# EAGLE design DVK2C-breakout (EAGLE 9.0.1)
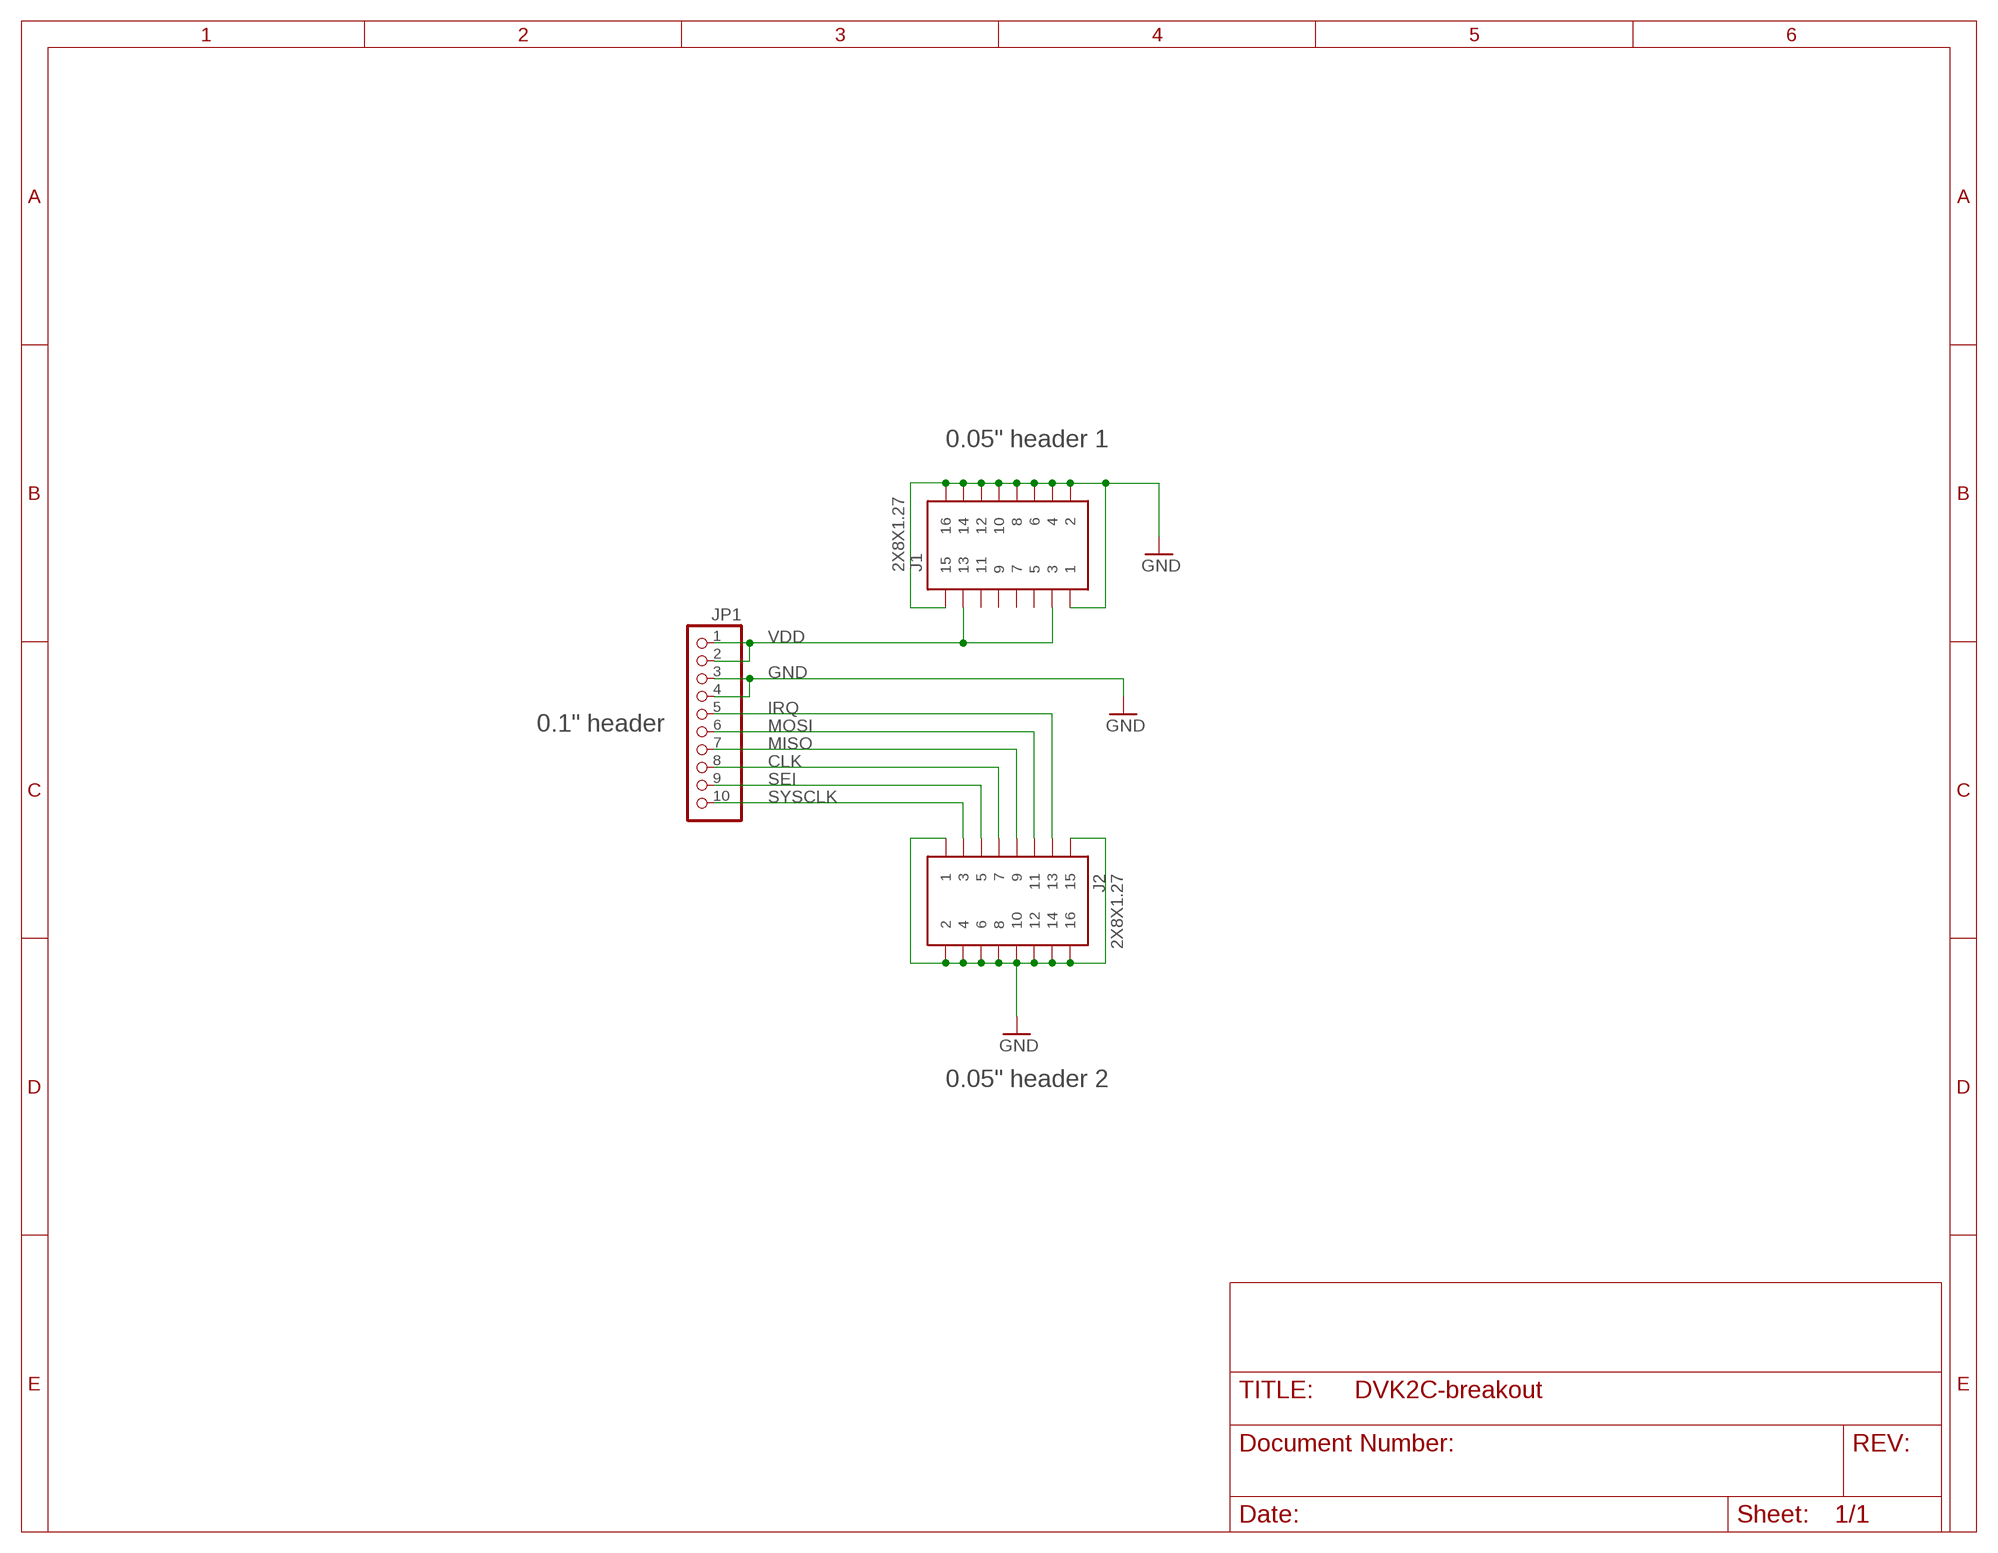
[diagram p0: schematic, sheet 1]

## Parts
J1  2X8X1.27  [2X8X1.27]
J2  2X8X1.27  [2X8X1.27]
JP1  PINHD-1X10  [1X10]

## Nets
CLK: J2.7 JP1.8
GND: J1.1 J1.2 J1.4 J1.6 J1.8 J1.10 J1.12 J1.14 J1.15 J1.16 J2.1 J2.2 J2.4 J2.6 J2.8 J2.10 J2.12 J2.14 J2.15 J2.16 JP1.3 JP1.4
IRQ: J2.13 JP1.5
MISO: J2.9 JP1.7
MOSI: J2.11 JP1.6
SEI: J2.5 JP1.9
SYSCLK: J2.3 JP1.10
VDD: J1.3 J1.13 JP1.1 JP1.2
Unconnected: J1.5 J1.7 J1.9 J1.11

## Notes on the sheet
- 0.05" header 1
- 0.1" header
- 0.05" header 2

## Library data of the parts
J1 J2 = 2x8x1.27:2X8X1.27
JP1 = pinhead:PINHD-1X10: PIN HEADER

## Board
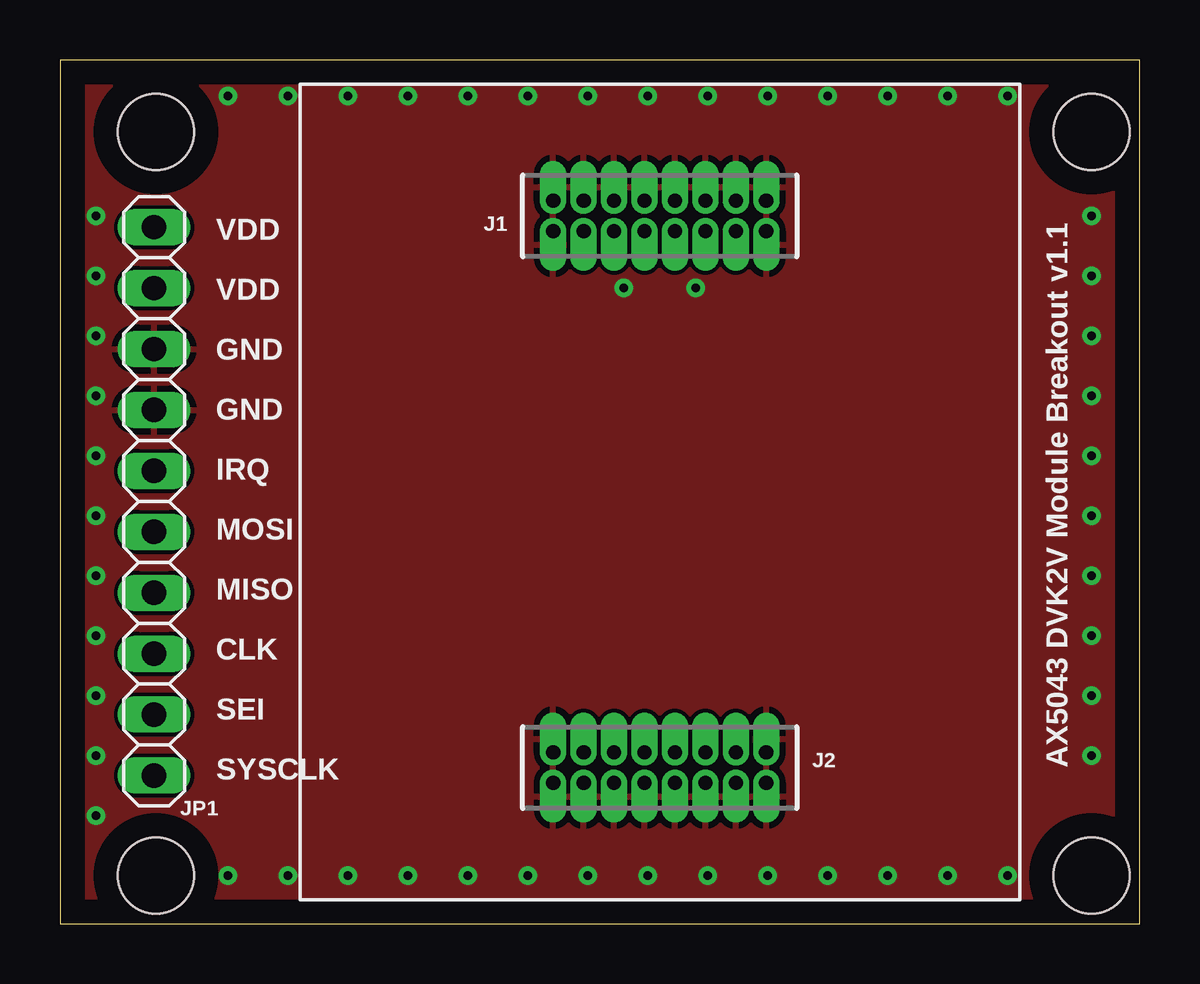
[diagram p1: board, top side]
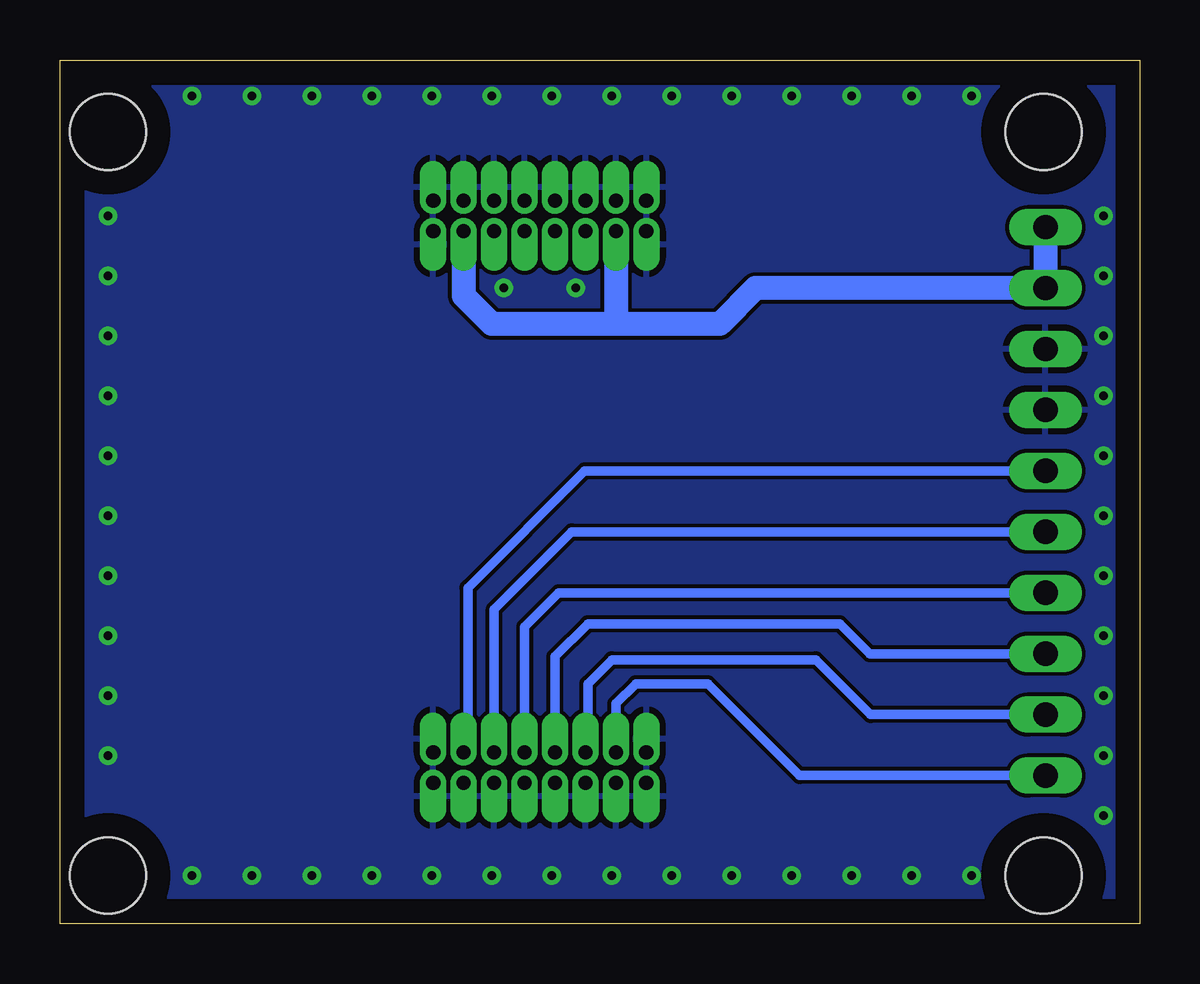
[diagram p2: board, bottom side, seen from below]

Size 45 x 36 mm. Coordinates in mm from the lower left corner, seen from the top.
Outline: 0,0 45,0 45,36 0,36 0,0
Copper layers (1*16): Top 0.035mm / dielectric 1.5mm / Bottom 0.035mm
Design rules "default": minimum track width 6mil, minimum drill 0.35mm, track to track 6mil, track to pad 6mil, pad to pad 6mil, via to via 6mil, smd to smd 6mil, copper to edge 40mil, drill to drill 6mil, minimum pad ring 10mil, minimum via ring 8mil, stop-mask expansion 4mil, vias tented up to drill 0mil, thermal gap 10mil
Holes 3.17 mm at 4,33 4,2 43,2 43,33

### Footprints (pad centres in the part's own frame; a part is rotated, then mirrored left to right if it is on the bottom)
2X8X1.27 = drill 0.6 pad 1.016 offset: 1 -4.445,0.635; 2 -4.445,-0.635; 3 -3.175,0.635; 4 -3.175,-0.635; 5 -1.905,0.635; 6 -1.905,-0.635; 7 -0.635,0.635; 8 -0.635,-0.635; 9 0.635,0.635; 10 0.635,-0.635; 11 1.905,0.635; 12 1.905,-0.635; 13 3.175,0.635; 14 3.175,-0.635; 15 4.445,0.635; 16 4.445,-0.635
1X10 = drill 1.016 long: 1 -11.43,0; 2 -8.89,0; 3 -6.35,0; 4 -3.81,0; 5 -1.27,0; 6 1.27,0; 7 3.81,0; 8 6.35,0; 9 8.89,0; 10 11.43,0

### Placement (x,y rotation side)
J1  25,29.5 180 top
J2  25,6.5 0 top
JP1  3.92,17.6 270 top

### Tracks (layer width: path | path; a pad name or v marks a point on that pad's centre or on a via)
CLK
  Bottom 0.4: J2.7 24.36,11.13 23,12.5 12.5,12.5 11.25,11.25 JP1.8
GND  (via drill 0.35)
  other vias: 23.5,26.5 26.5,26.5 7,34.5 9.5,34.5 12,34.5 14.5,34.5 17,34.5 19.5,34.5 22,34.5 24.5,34.5 27,34.5 29.5,34.5 32,34.5 34.5,34.5 37,34.5 39.5,34.5 43,29.5 43,27 43,24.5 43,22 43,19.5 43,17 43,14.5 43,12 43,9.5 43,7 39.5,2 37,2 34.5,2 32,2 29.5,2 27,2 24.5,2 22,2 19.5,2 17,2 14.5,2 12,2 9.5,2 7,2 1.5,4.5 1.5,7 1.5,9.5 1.5,12 1.5,14.5 1.5,17 1.5,19.5 1.5,22 1.5,24.5 1.5,27 1.5,29.5
  pour Bottom: 0,36 0,0 45,0 45,36
  pour Top: 0,36 0,0 45,0 45,36
IRQ
  Bottom 0.4: J2.13 28,7.81 28,14 23.13,18.87 JP1.5
MISO
  Bottom 0.4: J2.9 25.64,12.37 24.21,13.79 JP1.7
MOSI
  Bottom 0.4: JP1.6 23.67,16.33 26.91,13.1 J2.11
SEI
  Bottom 0.4: J2.5 23,7.73 23,10 22,11 13.5,11 11.21,8.71 JP1.9
SYSCLK
  Bottom 0.4: 21.82,8.18 J2.3 21.82,9.18 21,10 18,10 14.17,6.17 JP1.10
VDD
  Bottom 1: J1.3 28.18,26.18 27,25 22,25 | 22,25 17.5,25 16.01,26.49 JP1.2 JP1.1 3.95,29 | J1.13 21.82,25.18 22,25

### Text on the board
tPlace: VDD | VDD | GND | GND | IRQ | MOSI | MISO | CLK | SEI | SYSCLK | AX5043 DVK2V Module Breakout v1.1
tDocu: AX5043 Dev Board Breakout / OreSat 2019/08/07 | VDD | * | VDD | J1 | IRQ | MOSI | MISO | CLK | SEI | * | SYS CLK | J2